# EAGLE design BigClown_GPS_Teseo-LIV3F_module_v1.0 (EAGLE 9.2.2)
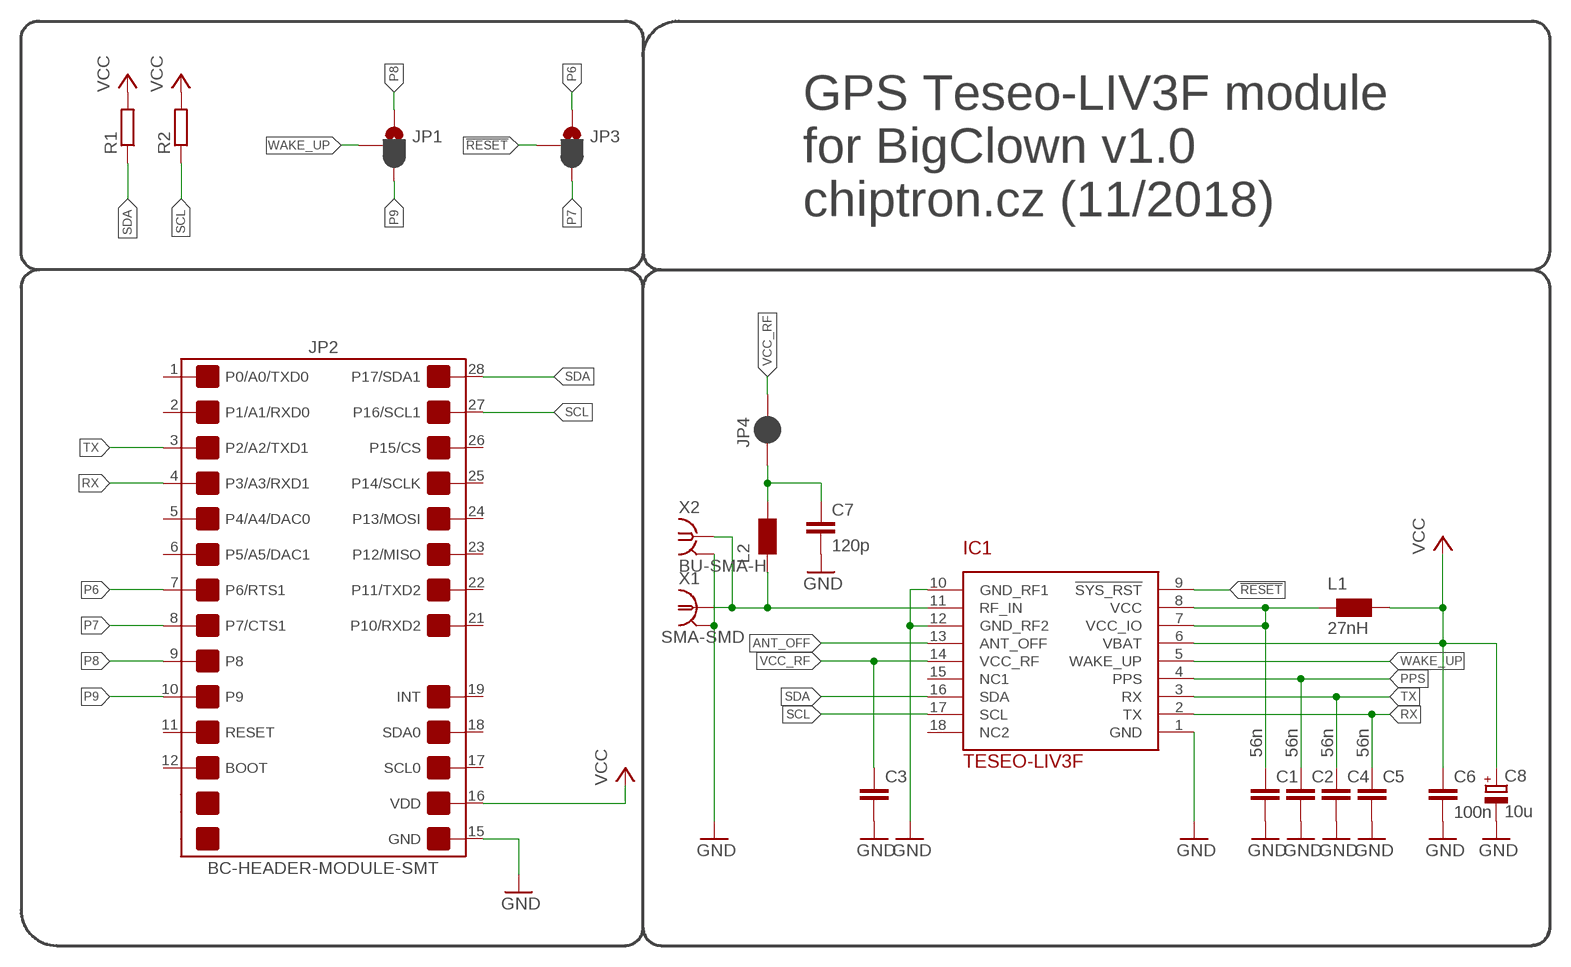
[diagram p0: schematic, sheet 1]

## Parts
C1  56n  C-EUC0805  [C0805]
C2  56n  C-EUC0805  [C0805]
C3  C-EUC0805  [C0805]
C4  56n  C-EUC0805  [C0805]
C5  56n  C-EUC0805  [C0805]
C6  100n  C-EUC0805  [C0805]
C7  120p  C-EUC0805  [C0805]
C8  10u  CPOL-EUSMCB  [SMC_B]
IC1  TESEO-LIV3F  [TESEO-LIV3F]
JP1  JUMPER-SMT_3_1-NC_PASTE_SILK  [SMT-JUMPER_3_1-NC_PASTE_SILK]
JP2  BC-HEADER-MODULE-SMT  [BC-HEADER-MODULE-SMT]
JP3  JUMPER-SMT_3_1-NC_PASTE_SILK  [SMT-JUMPER_3_1-NC_PASTE_SILK]
JP4  JUMPER-SMT_2_NC_PASTE_SILK  [SMT-JUMPER_2_NC_PASTE_SILK]
L1  27nH  WE-MK_0805  [0805]
L2  33nF  WE-MK_0805  [0805]
R1  R-EU_M0805  [M0805]
R2  R-EU_M0805  [M0805]
X1  SMA-SMD  [SMA-SMD]
X2  BU-SMA-H  [BU-SMA-H]

## Nets
!RESET: IC1.9(!SYS_RST) JP3.2
ANT_OFF: IC1.13(ANT_OFF)
GND: C1.2 C2.2 C3.2 C4.2 C5.2 C6.2 C7.2 C8.- IC1.1(GND) IC1.10(GND_RF1) IC1.12(GND_RF2) JP2.15(GND) X1.2@1 X1.2@2 X1.2@3 X1.2@4 X1.2@5 X1.2@6 X2.2 X2.3 X2.4 X2.5
N$1: C1.1 IC1.7(VCC_IO) IC1.8(VCC) L1.1
N$2: IC1.11(RF_IN) L2.1 X1.1 X2.1
N$3: C7.1 JP4.1 L2.2
P6: JP2.7(P6/RTS1) JP3.1
P7: JP2.8(P7/CTS1) JP3.3
P8: JP1.1 JP2.9(P8)
P9: JP1.3 JP2.10(P9)
PPS: C2.1 IC1.4(PPS)
RX: C5.1 IC1.2(TX) JP2.4(P3/A3/RXD1)
SCL: IC1.17(SCL) JP2.27(P16/SCL1) R2.1
SDA: IC1.16(SDA) JP2.28(P17/SDA1) R1.1
TX: C4.1 IC1.3(RX) JP2.3(P2/A2/TXD1)
VCC: C6.1 C8.+ IC1.6(VBAT) JP2.16(VDD) L1.2 R1.2 R2.2
VCC_RF: C3.1 IC1.14(VCC_RF) JP4.2
WAKE_UP: IC1.5(WAKE_UP) JP1.2
Unconnected: IC1.15(NC1) IC1.18(NC2) JP2.1(P0/A0/TXD0) JP2.2(P1/A1/RXD0) JP2.5(P4/A4/DAC0) JP2.6(P5/A5/DAC1) JP2.11(RESET) JP2.12(BOOT) JP2.17(SCL0) JP2.18(SDA0) JP2.19(INT) JP2.21(P10/RXD2) JP2.22(P11/TXD2) JP2.23(P12/MISO) JP2.24(P13/MOSI) JP2.25(P14/SCLK) JP2.26(P15/CS)

## Notes on the sheet
- GPS Teseo-LIV3F module
  for BigClown v1.0
  chiptron.cz (11/2018)

## Library data of the parts
C1-C7 = rcl:C-EU: CAPACITOR, European symbol; SPICEPREFIX: C
C8 = rcl:CPOL-EU: POLARIZED CAPACITOR, European symbol; SPICEPREFIX: C
IC1 = chiptron_cz:TESEO-LIV3F: Teseo-LIV3F
JP1 JP3 = SparkFun-Jumpers:JUMPER-SMT_3_1-NC_PASTE: Normally closed solder jumper (1 of 2 connections) This jumper has an aperture in the stencil to allow solder paste to bridge one of the two connections. One connection is normally closed (NC), while the other is normally open (NO). Wick off the solder to open the connection. Reapply solder to reclose the connection. Apply solder to the other side instead to change the current path.
JP2 = bc-header:BC-HEADER-MODULE-SMT: 14pin SMT socket / header +14pin SMT socket / header empty pin 6 Use this pattern for a standard floor Module of BigClown stackup without additional power supply with dirrect connection between top and bottom side of PCB (e. g. Tag Module, CO2 Module, Relay Module, Sensor Module). Mounting Technology: SMT; BCPN: -
JP4 = SparkFun-Jumpers:JUMPER-SMT_2_NC_PASTE: Normally closed solder jumper This jumper has an aperture in the stencil to allow solder paste to bridge the split in the wire so it's normally closed (NC). Wick off the solder to open the connection. Reapply solder to reclose the connection.
L1 L2 = wuerth-elektronik:WE-MK: SMD Multilayer Ceramic Inductors WE-MK - Windings printed on ceramic substrate - Extremely high SRF > 15 GHz - Inductance is stable over temperature -- High frequency circuits -- Bluetooth -- Wireless LAN -- Filter circuits
R1 R2 = rcl:R-EU_: RESISTOR, European symbol; SPICEPREFIX: R
X1 = con-coax:SMA-SMD: SMA 50 Ohm Straight Jack Receptacle - Surface Mount www.johnsoncomponents.com Source: http://catalog.digikey.com .. 142-0711-201, 205, 202, 206.pdf; OC_FARNELL: unknown; OC_NEWARK: unknown
X2 = con-coax:BU-SMA-H: FEMALE SMA CONNECTOR Radiall; OC_FARNELL: unknown; OC_NEWARK: unknown

## Board
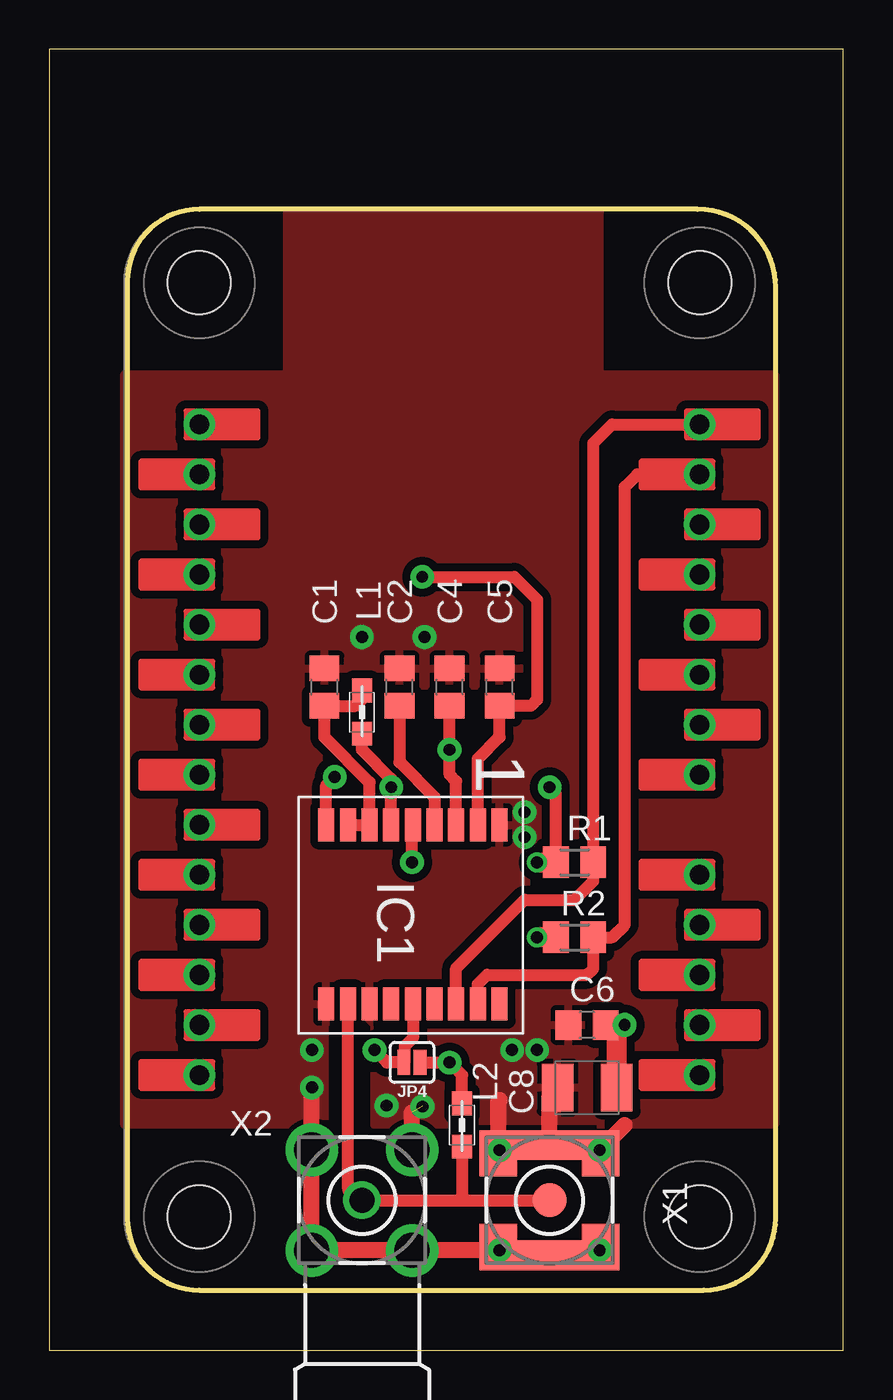
[diagram p1: board, top side]
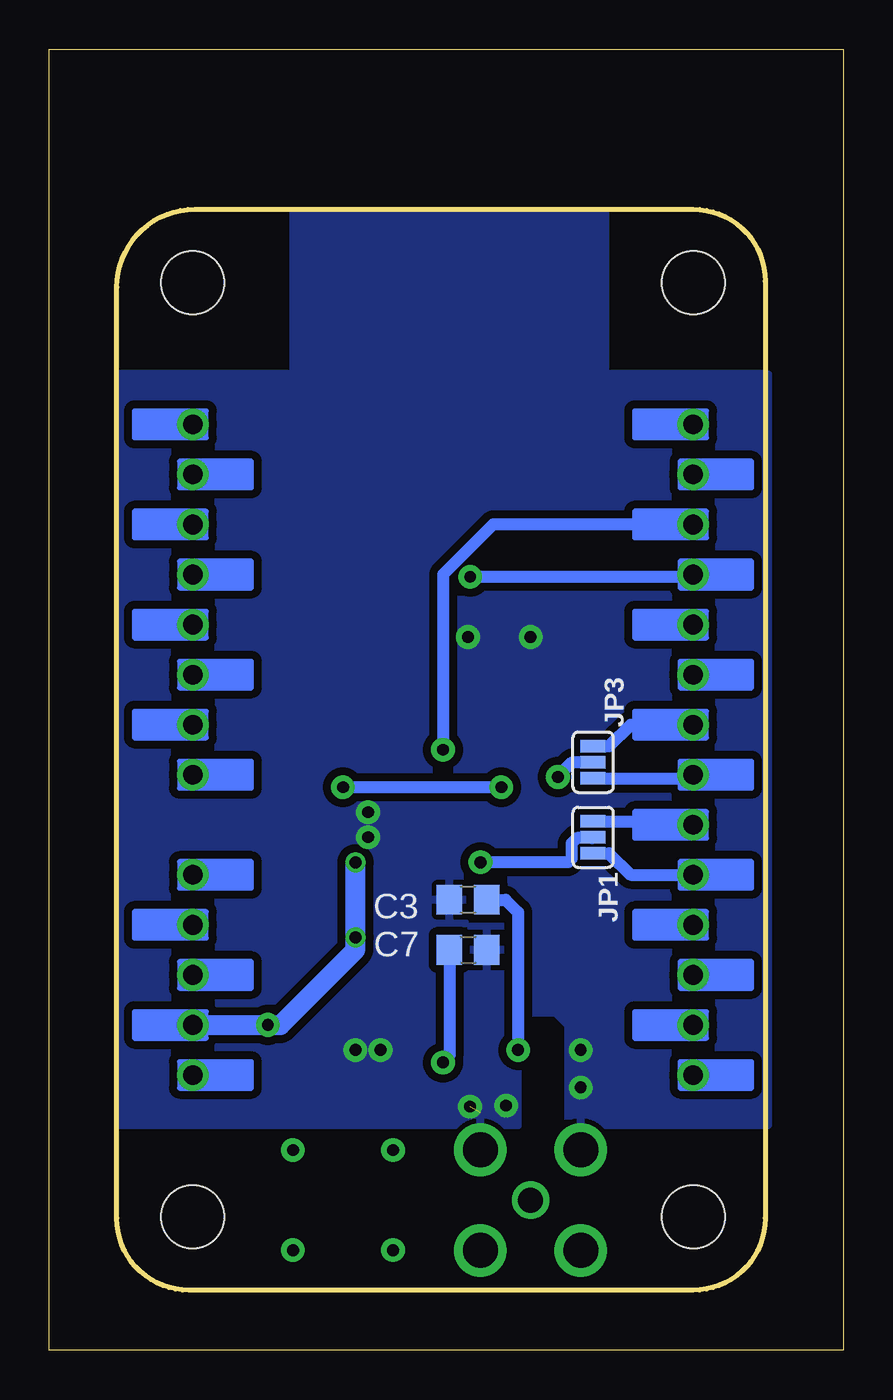
[diagram p2: board, bottom side, seen from below]

Size 40.31 x 66.03 mm. Coordinates in mm from the lower left corner, seen from the top.
Outline: 0,0 40.31,0 40.31,66.03 0,66.03 0,0
Copper layers (1*16): Top 0.035mm / dielectric 1.5mm / Bottom 0.035mm
Design rules "default *": minimum track width 6mil, minimum drill 0.35mm, track to track 6mil, track to pad 6mil, pad to pad 6mil, via to via 6mil, smd to smd 6mil, copper to edge 40mil, drill to drill 6mil, minimum pad ring 10mil, minimum via ring 8mil, stop-mask expansion 4mil, vias tented up to drill 0mil, thermal gap 10mil
Milling: 8 lines

### Footprints (pad centres in the part's own frame; a part is rotated, then mirrored left to right if it is on the bottom)
C0805 = smd 1.3 x 1.5: 1 -0.95,0; 2 0.95,0
SMC_B = smd 1.6 x 2.4: + -1.5,0; - 1.5,0
TESEO-LIV3F = smd 0.813 x 1.676: 1 0,0; 2 -1.1,0; 3 -2.2,0; 4 -3.3,0; 5 -4.4,0; 6 -5.5,0; 7 -6.6,0; 8 -7.7,0; 9 -8.8,0; 10 -8.8,-9.1; 11 -7.7,-9.1; 12 -6.6,-9.1; 13 -5.5,-9.1; 14 -4.4,-9.1; 15 -3.3,-9.1; 16 -2.2,-9.1; 17 -1.1,-9.1; 18 0,-9.1
SMT-JUMPER_3_1-NC_PASTE_SILK = smd 0.635 x 1.27: 1 -0.813,0; 2 0,0; 3 0.813,0
BC-HEADER-MODULE-SMT = drill 1 pad 1.6: 1 -12.7,16.51; 2 -12.7,13.97; 3 -12.7,11.43; 4 -12.7,8.89; 5 -12.7,6.35; 6 -12.7,3.81; 7 -12.7,1.27; 8 -12.7,-1.27; 9 -12.7,-3.81; 10 -12.7,-6.35; 11 -12.7,-8.89; 12 -12.7,-11.43; 13 -12.7,-13.97; 14 -12.7,-16.51; 15 12.7,-16.51; 16 12.7,-13.97; 17 12.7,-11.43; 18 12.7,-8.89; 19 12.7,-6.35; 21 12.7,-1.27; 22 12.7,1.27; 23 12.7,3.81; 24 12.7,6.35; 25 12.7,8.89; 26 12.7,11.43; 27 12.7,13.97; 28 12.7,16.51 | hole 3.2: -12.7,23.7; 12.7,23.7; -12.7,-23.7; 12.7,-23.7
SMT-JUMPER_2_NC_PASTE_SILK = smd 0.635 x 1.27: 1 -0.406,0; 2 0.406,0
0805 = smd 1.2 x 1: 1 -1.1,0; 2 1.1,0
M0805 = smd 1.3 x 1.6: 1 -0.95,0; 2 0.95,0
SMA-SMD = smd 1.73 x 1.73: 1 0,0 | smd 2.35 x 1.9: 2@1 -2.375,2.6; 2@2 -2.375,-2.6; 2@3 2.375,-2.6; 2@4 2.375,2.6 | smd 1.5 x 3.4: 2@5 -2.8,0; 2@6 2.8,0
BU-SMA-H = drill 1.27: 1 0,0 | drill 1.778: 2 -2.55,2.55; 3 2.55,2.55; 4 2.55,-2.55; 5 -2.55,-2.55

### Placement (x,y rotation side)
C1  13.97,33.66 90 top
C2  17.78,33.66 90 top
C3  19.05,22.86 180 bottom
C4  20.32,33.66 90 top
C5  22.86,33.66 90 top
C6  27.3,16.51 180 top
C7  19.05,20.32 0 bottom
C8  27.3,13.34 180 top
IC1  22.86,26.67 0 top
JP1  12.7,26.04 270 bottom
JP2  20.32,30.48 0 top
JP3  12.7,29.84 270 bottom
JP4  18.41,14.61 180 top
L1  15.88,32.38 270 top
L2  20.95,11.43 90 top
R1  26.67,24.77 180 top
R2  26.67,20.95 180 top
X1  25.4,7.62 90 top
X2  15.88,7.62 270 top

### Tracks (layer width: path | path; a pad name or v marks a point on that pad's centre or on a via)
!RESET  (via drill 0.6 pad 1.2)
  Top 0.61: IC1.9 14.06,28.66 v14.49,29.09
  Bottom 0.61: v14.49,29.09 13.74,29.84 JP3.2
GND  (via drill 0.6 pad 1.2)  (1 unrouted)
  Top 0.61: X1.2@1 23.23,4.82 X1.2@5 | X1.2@4 23.23,10.42 X1.2@6
  Top 0.813: v13.34,13.34 13.32,13.32 X2.5 X2.4 X2.3 22.62,5.07 X1.2@1 | C8.- 25.4,12.93 X1.2@6 27.57,10.42 X1.2@3 28,10.22 29.21,11.43 | X1.2@2 27.57,4.82 X1.2@5 | X2.2 18.41,12.06 | X1.2@4 22.8,12.64 22.86,12.7
  other vias: 24.77,15.24 15.88,36.2 19.05,36.2 24.13,27.3 24.13,26.04 23.5,15.24 18.95,12.37 17.12,12.42 13.34,15.24
  pour Top (isolate 0.406): 12.06,57.78 27.94,57.78 27.94,49.53 36.83,49.53 36.83,11.43 16.51,11.43 16.51,16.51 15.88,17.14 14.61,17.14 13.97,16.51 13.97,11.43 3.81,11.43 3.81,49.53 12.06,49.53
  pour Bottom (isolate 0.406): 12.06,57.78 27.94,57.78 27.94,49.53 36.83,49.53 36.83,11.43 16.51,11.43 16.51,16.51 15.88,17.14 14.61,17.14 13.97,16.51 13.97,11.43 3.81,11.43 3.81,49.53 12.06,49.53
N$1
  Top 0.61: L1.1 15.88,33.02 15.56,32.7 C1.1 13.97,31.11 16.26,28.82 IC1.7 IC1.8
N$2
  Top 0.61: IC1.11 15.16,8.34 arc90 X2.1 20.95,7.62 | 20.95,7.62 X1.1 | L2.1 20.95,7.62
N$3  (via drill 0.6 pad 1.2)
  Top 0.61: L2.2 20.95,13.97 v20.32,14.61 JP4.1
  Bottom 0.61: C7.1 20,14.93 v20.32,14.61
N$6  (via drill 0.6 pad 1.2)
  other vias: 22.86,10.16
N$7  (via drill 0.6 pad 1.2)
  other vias: 22.86,5.08
N$8  (via drill 0.6 pad 1.2)
  other vias: 27.94,5.08
N$9  (via drill 0.6 pad 1.2)
  other vias: 27.94,10.16
P6
  Bottom 0.61: JP3.1 11.89,30.66 10.79,31.75 JP2.7
P7
  Bottom 0.61: JP3.3 7.8,29.03 JP2.8
P8
  Bottom 0.61: JP1.1 7.8,26.85 JP2.9
P9
  Bottom 0.61: JP1.3 11.89,25.22 10.79,24.13 JP2.10
PPS
  Top 0.61: C2.1 17.78,29.84 19.56,28.07 IC1.4
RX  (via drill 0.6 pad 1.2)
  Top 0.61: IC1.2 21.76,30.02 22.86,31.11 C5.1 24.45,32.7 24.77,33.02 24.77,38.1 23.61,39.26 v18.93,39.26
  Bottom 0.61: JP2.4 7.74,39.26 v18.93,39.26
SCL
  Top 0.61: IC1.17 21.76,18.59 22.23,19.05 27.3,19.05 27.62,19.36 R2.1 28.57,20.95 29.21,21.59 29.21,43.81 29.84,44.45 JP2.27
SDA
  Top 0.61: IC1.16 20.66,19.39 24.13,22.86 26.67,22.86 27.62,23.81 R1.1 27.62,46.03 28.57,46.99 JP2.28
TX  (via drill 0.6 pad 1.2)
  Top 0.61: C4.1 v20.32,30.48 20.32,29.21 20.66,28.87 IC1.3
  Bottom 0.61: v20.32,30.48 20.32,39.37 17.78,41.91 JP2.3
VCC  (via drill 0.6, 0.6 pad 1.2)
  Top 0.61: IC1.6 v17.36,28.57 17.36,29 15.88,30.48 L1.2 | R1.2 25.72,28.25 v25.4,28.57
  Top 1.016: v24.77,24.77 R1.2 | R2.2 v24.77,20.95 | v29.21,16.51 C6.1 28.8,15.96 C8.+
  Bottom 0.61: v17.36,28.57 v25.4,28.57
  Bottom 1.016: JP2.16 v29.21,16.51 28.57,16.51 24.77,20.32 v24.77,20.95 v24.77,24.77
VCC_RF  (via drill 0.6 pad 1.2)
  Top 0.61: 16.55,15.29 v16.51,15.24 17.14,14.61 JP4.2 18.05,14.64 18.05,15.43 18.46,15.84 IC1.14
  Bottom 0.61: C3.1 17.14,22.86 16.51,22.23 v16.51,15.24
WAKE_UP  (via drill 0.6 pad 1.2)
  Top 0.61: v18.41,24.77 18.41,26.62 IC1.5
  Bottom 0.61: v18.41,24.77 13.97,24.77 13.79,24.94 13.79,25.73 13.52,26 12.74,26 JP1.2

### Text on the board
bDocu: GPS Teseo-LIV3F module / for BigClown v1.0 / chiptron.cz (11/2018)